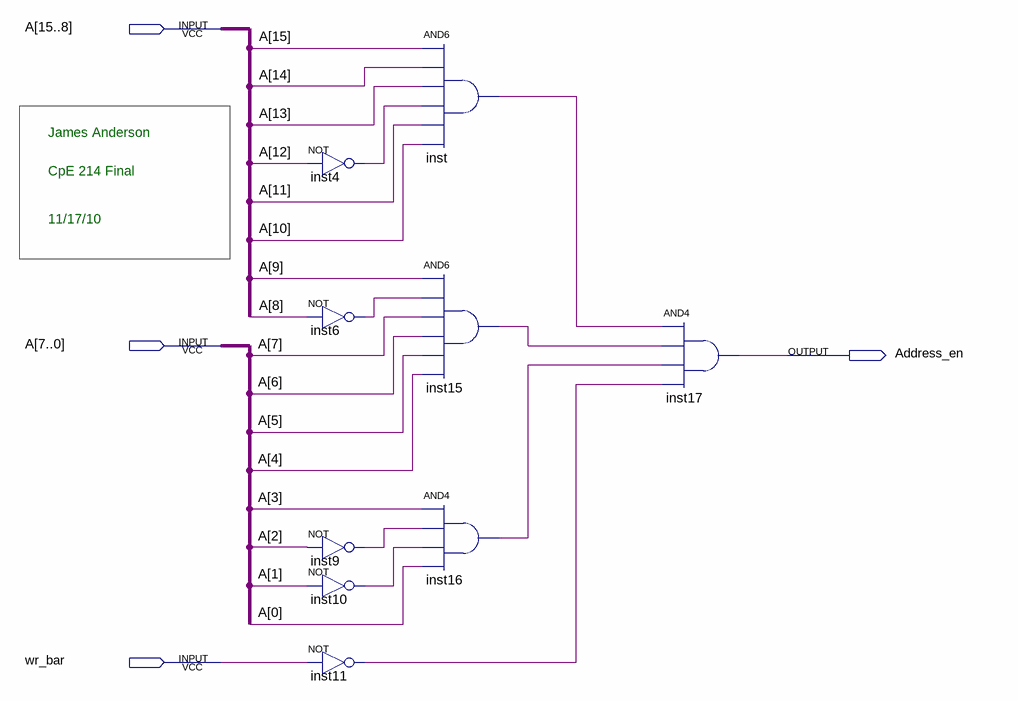
[diagram p0: schematic sheet]
// Quartus schematic address_decoder_final.bdf as structural Verilog: 9 symbols, 4 pins
module address_decoder_final (
  input  [15:0] A,
  input  wr_bar,
  output Address_en
);

  wire inst4_out, inst6_out, inst9_out, inst10_out, inst11_out, inst15_out, inst16_out, inst_out;

  not inst4 (inst4_out, A[12]);
  not inst6 (inst6_out, A[8]);
  not inst9 (inst9_out, A[2]);
  not inst10 (inst10_out, A[1]);
  not inst11 (inst11_out, wr_bar);
  and inst (inst_out, A[15], A[14], A[13], inst4_out, A[11], A[10]);
  and inst15 (inst15_out, A[9], inst6_out, A[7], A[6], A[5], A[4]);
  and inst16 (inst16_out, A[3], inst9_out, inst10_out, A[0]);
  and inst17 (Address_en, inst_out, inst15_out, inst16_out, inst11_out);

  // Notes on the sheet:
  //   James Anderson
  //   CpE 214 Final
  //   11/17/10
endmodule
